# Altium project sample_board.PrjPcb
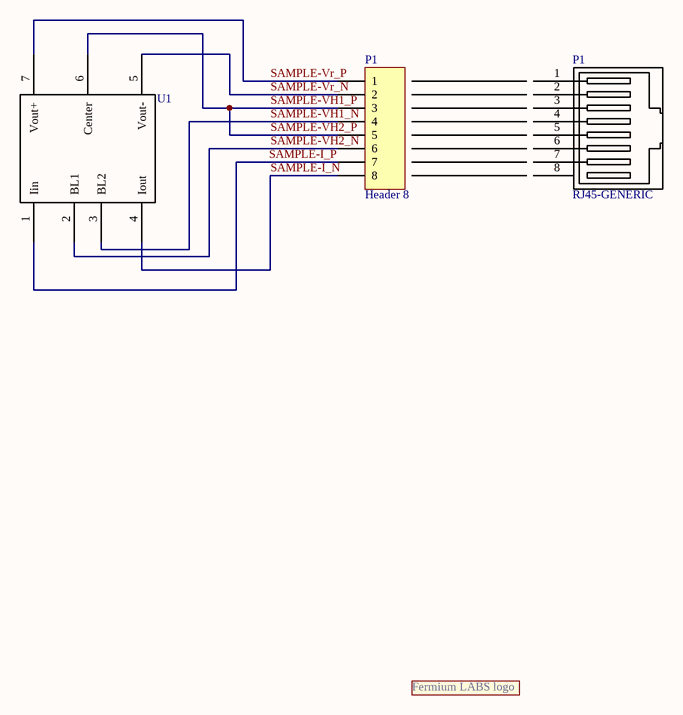
[diagram p0: sample_board.SchDoc]
1 sheet, 4 parts. Net scope: global (net labels, ports and power ports of the same name join across sheets).
Board file: sample_board.PcbDoc

## Sheet sample_board.SchDoc: Hall / Sample board
size A4; DocumentNumber: 1; SheetNumber: 1; SheetTotal: 1

### Parts
(Parts that share a designator on the sheet are numbered #1, #2 ... from top to bottom, then left to right.)
logo  fermiumlabs-logo  [frm-med]  (value not drawn)  (no BOM)
P1#1  Header 8  [Edge Connector]  (no BOM)
P1#2  RJ45-GENERIC  [RJ45-8/8S]  (graphical)
U1  (no value)  [Germanium Sample]

### Nets
SAMPLE-I_N: P1#1.8 U1.4(Iout)
SAMPLE-I_P: P1#1.7 U1.1(Iin)
SAMPLE-VH1_N: P1#1.4 U1.3(BL2)
SAMPLE-VH1_P: P1#1.3 P1#1.5 U1.6(Center)  [also labelled SAMPLE-VH2_P]
SAMPLE-VH2_N: P1#1.6 U1.2(BL1)
SAMPLE-Vr_N: P1#1.2 U1.5(Vout-)
SAMPLE-Vr_P: P1#1.1 U1.7(Vout+)

Not connected (* = marked no-connect by the designer): P1#2 1 2 3 4 5 6 7 8

### Notes on the sheet
- Title
- Size:
- Date:
- A4
- Number:
- Time:
- Revision:
- Sheet
- of
- Fermium LABS srl
- Via Monselice 15a
- 35142 Padova PD
- Italy
- File:
- (in symbol fermiumlabs-logo) Fermium LABS logo

### Library data of the parts
P1#1 = Header 8: Header, 8-Pin; LatestRevisionDate: 17-Jul-2002; LatestRevisionNote: Re-released for DXP Platform.; Publisher: Altium Limited; Pads: N/A
P1#2 = RJ45-GENERIC: GENERIC RJ45 CONNECTOR 8 PIN
U1 = Germanium Sample: Sample germanium; Manufacturer: Fermium LABS; Supplier 1: Fermium LABS; Supplier Part Number 1: ge-p-sample; Pads: N/A